# EAGLE design Ex Sensors (EAGLE 7.6.0)
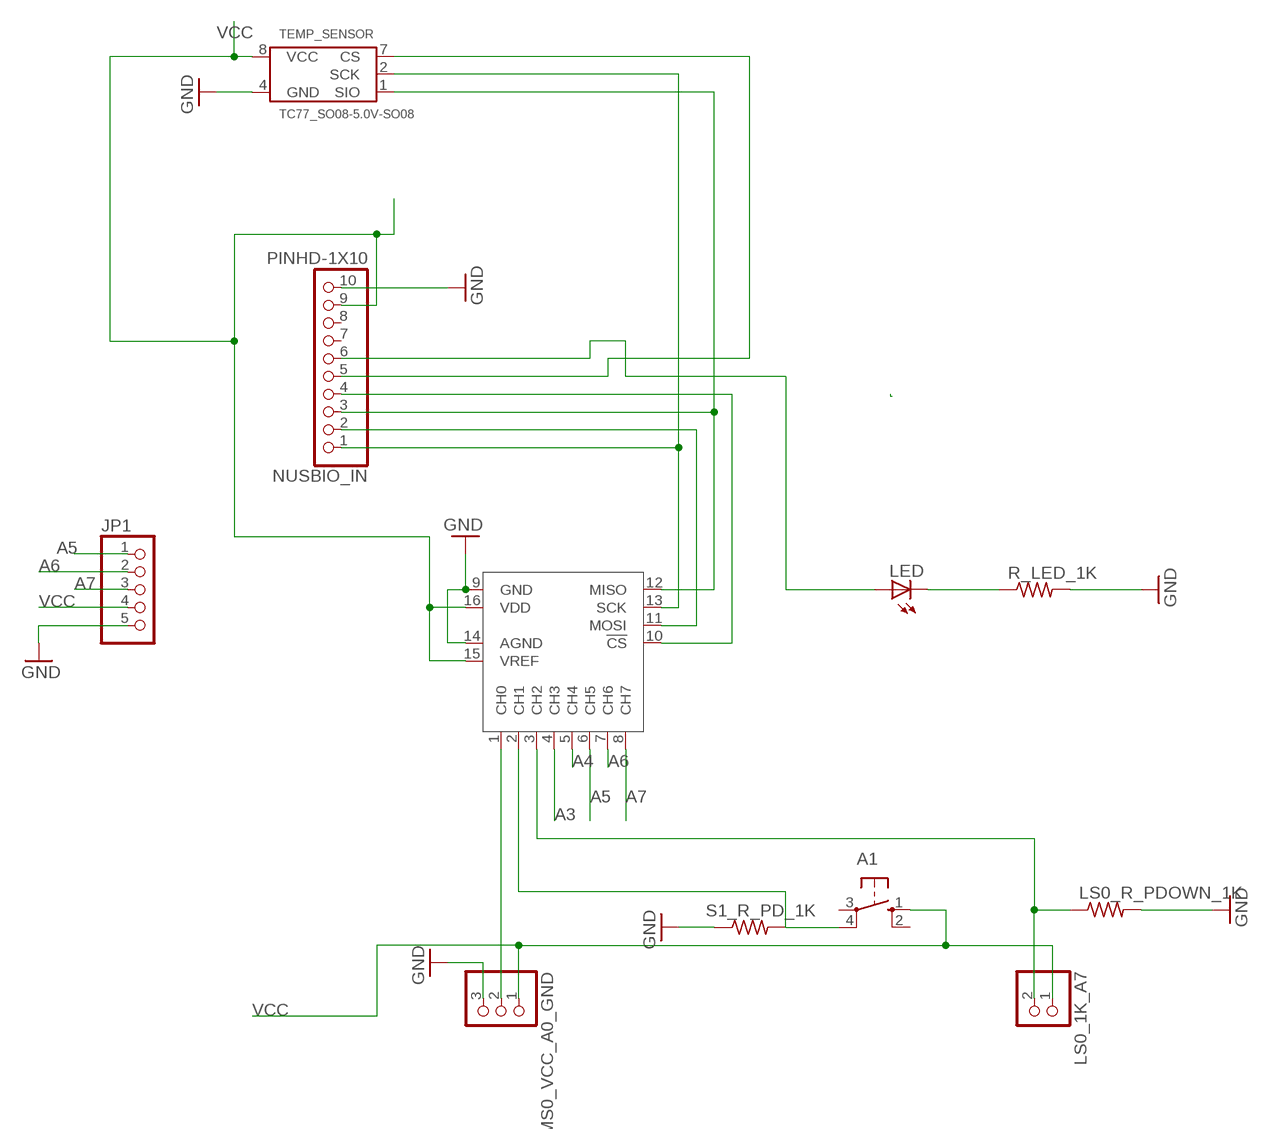
[diagram p0: schematic, sheet 1]

## Parts
A1  10-XX  [B3F-10XX]
JP1  PINHD-1X5  [1X05]
LED  LEDCHIPLED_0805  [CHIPLED_0805]
LS0_1K_A7  PINHD-1X2  [1X02]
LS0_R_PDOWN_1K  R-US_R0805  [R0805]
MS0_VCC_A0_GND  PINHD-1X3  [1X03]
NUSBIO_IN  PINHD-1X10  [1X10-BIG]
R_LED_1K  R-US_R0805  [R0805]
S1_R_PD_1K  R-US_R0805  [R0805]
TEMP_SENSOR  TC77_SO08-5.0V-SO08  [SO-08]
U$1  MCP3008SL  [SO16]

## Nets
A3: U$1.4(CH3)
A4: U$1.5(CH4)
A5: JP1.1 U$1.6(CH5)
A6: JP1.2 U$1.7(CH6)
A7: JP1.3 U$1.8(CH7)
GND: JP1.5 LS0_R_PDOWN_1K.2 MS0_VCC_A0_GND.3 NUSBIO_IN.10 R_LED_1K.2 S1_R_PD_1K.1 TEMP_SENSOR.4(GND) U$1.9(GND) U$1.14(AGND)
N$1: NUSBIO_IN.1 TEMP_SENSOR.2(SCK) U$1.13(SCK)
N$2: NUSBIO_IN.2 U$1.11(MOSI)
N$3: NUSBIO_IN.3 TEMP_SENSOR.1(SIO) U$1.12(MISO)
N$4: NUSBIO_IN.5 TEMP_SENSOR.7(CS)
N$5: NUSBIO_IN.4 U$1.10(!CS)
N$6: LED.C R_LED_1K.1
N$7: LED.A NUSBIO_IN.6
N$10: MS0_VCC_A0_GND.2 U$1.1(CH0)
N$11: LS0_1K_A7.2 LS0_R_PDOWN_1K.1 U$1.3(CH2)
N$12: A1.4(P1) S1_R_PD_1K.2 U$1.2(CH1)
VCC: A1.1(S) JP1.4 LS0_1K_A7.1 MS0_VCC_A0_GND.1 NUSBIO_IN.9 TEMP_SENSOR.8(VCC) U$1.15(VREF) U$1.16(VDD)
Unconnected: A1.2(S1) A1.3(P) NUSBIO_IN.7 NUSBIO_IN.8

## Library data of the parts
A1 = switch-omron:10-XX: OMRON SWITCH; MPN: B3F-1000; OC_FARNELL: 176432; OC_NEWARK: 36M3542
JP1 = pinhead:PINHD-1X5: PIN HEADER
LED = adafruit:LED: LED OSRAM: - CHIPLED LG R971, LG N971, LY N971, LG Q971, LY Q971, LO R971, LY R971 LH N974, LH R974 LS Q976, LO Q976, LY Q976 LO Q996 - Hyper CHIPLED LW Q18S LB Q993, LB Q99A, LB R99A - SideLED LS A670, LO A670, LY A670, LG A670, LP A670 LB A673, LV A673, LT A673, LW A673 LH A674 LY A675 LS A676, LA A676, LO A676, LY A676, LW A676 LS A679, LY A679, LG A679 - Hyper Micro SIDELED® LS Y876, LA Y876, LO Y876, LY Y876 LT Y87S - SmartLED LW L88C, LW L88S LB L89C, LB L89S, LG L890 LS L89K, LO L89K, LY L89K LS L896, LA L896, LO L896, LY L896 - TOPLED LS T670, LO T670, LY T670, LG T670, LP T670 LSG T670, LSP T670, LSY T670, LOP T670, LYG T670 LG T671, LOG T671, LSG T671 LB T673, LV T673, LT T673, LW T673 LH T674 LS T676, LA T676, LO T676, LY T676, LB T676, LH T676, LSB T676, LW T676 LB T67C, LV T67C, LT T67C, LS T67K, LO T67K, LY T67K, LW E67C LS E67B, LA E67B, LO E67B, LY E67B, LB E67C, LV E67C, LT E67C LW T67C LS T679, LY T679, LG T679 LS T770, LO T770, LY T770, LG T770, LP T770 LB T773, LV T773, LT T773, LW T773 LH T774 LS E675, LA E675, LY E675, LS T675 LS T776, LA T776, LO T776, LY T776, LB T776 LHGB T686 LT T68C, LB T68C - Hyper Mini TOPLED® LB M676 - Mini TOPLED Santana® LG M470 LS M47K, LO M47K, LY M47K Source: http://www.osram.convergy.de/
LS0_1K_A7 = pinhead:PINHD-1X2: PIN HEADER
LS0_R_PDOWN_1K R_LED_1K S1_R_PD_1K = adafruit:R-US_: RESISTOR, American symbol
MS0_VCC_A0_GND = adafruit:PINHD-1X3: PIN HEADER
NUSBIO_IN = adafruit:PINHD-1X10: Pin header 1x10 0.1" spacing With round pins
TEMP_SENSOR = temperiture:TC77_SO08: Thermal Sensor with SPI™ Interface TC77 Features • Digital Temperature Sensing in 5-Pin SOT-23A and 8-Pin SOIC Packages • Outputs Temperature as a 13-Bit Digital Word • SPI and MICROWIRE™ Compatible Interface • Solid State Temperature Sensing • ±1°C (max.) accuracy from +25°C to +65°C • ±2°C (max.) accuracy from -40°C to +85°C • ±3°C (max.) accuracy from -55°C to +125°C • 2.7V to 5.5V Operating Range • Low Power - 250 μA (typ.) Continuous Conversion Mode - 0.1 μA (typ.) Shutdown Mode Typical Applications • Thermal Protection for Hard Disk Drives and Other PC Peripherals • PC Card Devices for Notebook Computers • Low Cost Thermostat Controls • Industrial Control • Office Equipment • Cellular Phones • Thermistor Replacement Description The TC77 is a serially accessible digital temperature sensor particularly suited for low cost and small formfactor applications. Temperature data is converted from the internal thermal sensing element and made available at anytime as a 13-bit two’s compliment digital word. Communication with the TC77 is accomplished via a SPI and MICROWIRE compatible interface. It has a 12-bit plus sign temperature resolution of 0.0625°C per Least Significant Bit (LSb). The TC77 offers a temperature accuracy of ±1.0°C (max.) over the temperature range of +25°C to +65°C. When operating, the TC77 consumes only 250 μA (typ.). The TC77’s Configuration register can be used to activate the low power Shutdown mode, which has a current consumption of only 0.1 μA (typ.). Small size, low cost and ease of use make the TC77 an ideal choice for implementing thermal management in a variety of systems.; MPN: TC77-5.0MOA; OC_FARNELL: 1439514; PACKAGE: SO08; SUPPLIER: MICROCHIP
U$1 = MCP3008:MCP3008

## Board
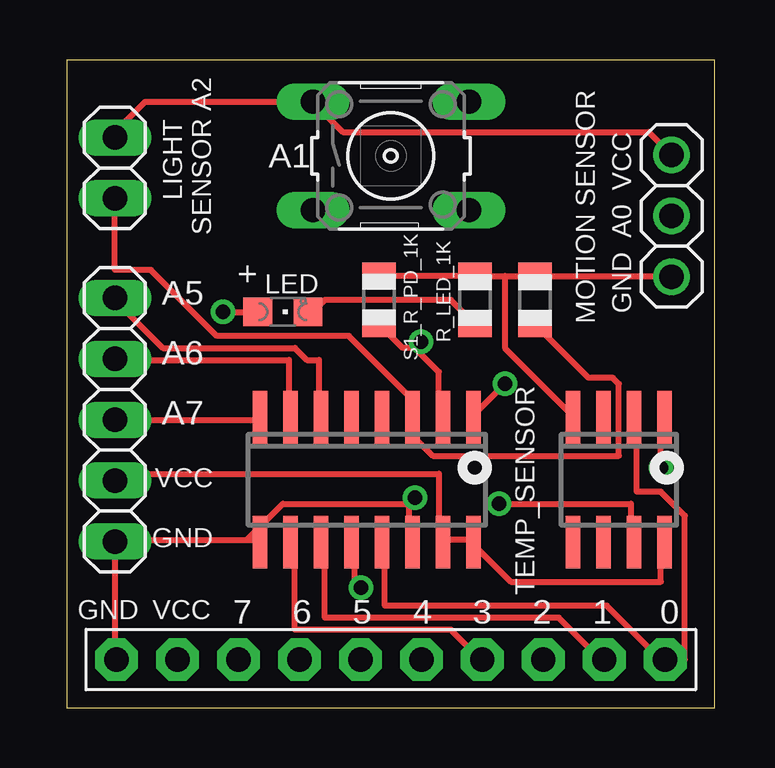
[diagram p1: board, top side]
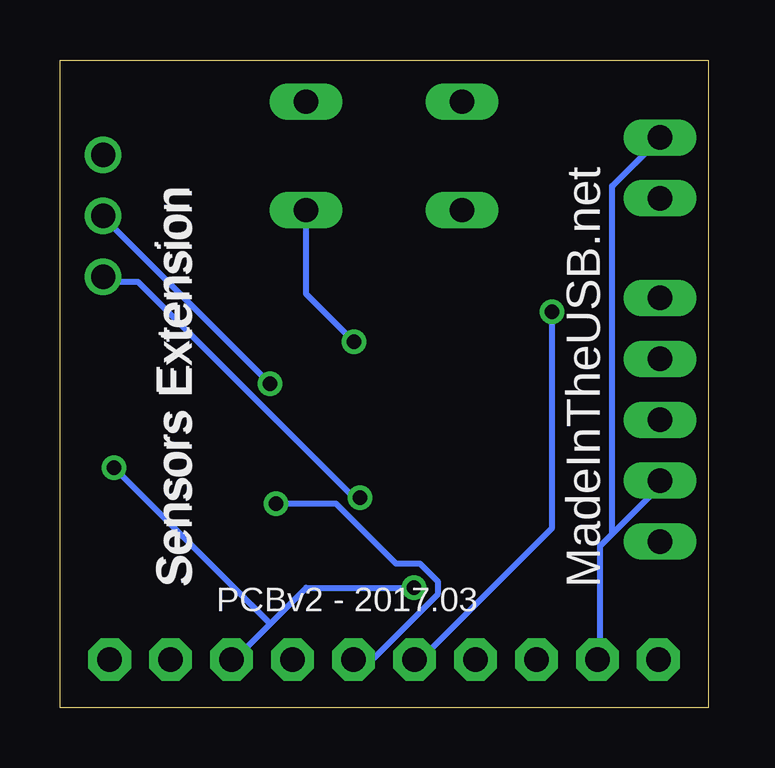
[diagram p2: board, bottom side, seen from below]

Size 27 x 27 mm. Coordinates in mm from the lower left corner, seen from the top.
Outline: 0,0 27,0 27,27 0,27 0,0
Copper layers (1*16): Top 0.035mm / dielectric 1.5mm / Bottom 0.035mm
Design rules "default": minimum track width 10mil, minimum drill 24mil, track to track 8mil, track to pad 8mil, pad to pad 8mil, via to via 8mil, smd to smd 8mil, copper to edge 40mil, drill to drill 8mil, minimum pad ring 10mil, minimum via ring 8mil, stop-mask expansion 4mil, vias tented up to drill 0mil, thermal gap 10mil

### Footprints (pad centres in the part's own frame; a part is rotated, then mirrored left to right if it is on the bottom)
B3F-10XX = drill 1.016 long: 1 -3.251,2.261; 2 3.251,2.261; 3 -3.251,-2.261; 4 3.251,-2.261
1X05 = drill 1.016 long: 1 -5.08,0; 2 -2.54,0; 3 0,0; 4 2.54,0; 5 5.08,0
CHIPLED_0805 = smd 1.2 x 1.2: A 0,-1.05; C 0,1.05
1X02 = drill 1.016 long: 1 -1.27,0; 2 1.27,0
R0805 = smd 1.1 x 1.4: 1 -1,0; 2 1,0
1X03 = drill 1.016: 1 -2.54,0; 2 0,0; 3 2.54,0
1X10-BIG = drill 1.016 pad 1.778 octagon: 1 -11.43,0; 2 -8.89,0; 3 -6.35,0; 4 -3.81,0; 5 -1.27,0; 6 1.27,0; 7 3.81,0; 8 6.35,0; 9 8.89,0; 10 11.43,0
SO-08 = smd 0.6 x 2.2: 1 -1.905,-2.6; 2 -0.635,-2.6; 3 0.635,-2.6; 4 1.905,-2.6; 5 1.905,2.6; 6 0.635,2.6; 7 -0.635,2.6; 8 -1.905,2.6
SO16 = smd 0.6 x 2.2: 1 -4.445,-2.6; 2 -3.175,-2.6; 3 -1.905,-2.6; 4 -0.635,-2.6; 5 0.635,-2.6; 6 1.905,-2.6; 7 3.175,-2.6; 8 4.445,-2.6; 9 4.445,2.6; 10 3.175,2.6; 11 1.905,2.6; 12 0.635,2.6; 13 -0.635,2.6; 14 -1.905,2.6; 15 -3.175,2.6; 16 -4.445,2.6

### Placement (x,y rotation side)
A1  13.5,23 0 top
JP1  2,12 270 top
LED  9,16.5 270 top
LS0_1K_A7  2,22.5 270 top
LS0_R_PDOWN_1K  19.5,17 90 top
MS0_VCC_A0_GND  25.2,20.5 270 top
NUSBIO_IN  13.5,2 180 top
R_LED_1K  17,17 90 top
S1_R_PD_1K  13,17 270 top
TEMP_SENSOR  23,9.5 180 top
U$1  12.5,9.5 180 top

### Tracks (layer width: path | path; a pad name or v marks a point on that pad's centre or on a via)
A5
  Top 0.254: U$1.6 10.5,12.25 10.5,14.5 10,14.5 9.5,15 4,15 2,17 JP1.1
A6
  Top 0.254: U$1.7 9.25,12.25 9.25,14.5 2,14.5 JP1.2
A7
  Top 0.254: JP1.3 8,12 U$1.8
GND  (via drill 0.61)
  Top 0.254: S1_R_PD_1K.1 R_LED_1K.2 18.25,18 | 18.25,18 LS0_R_PDOWN_1K.2 25,18 MS0_VCC_A0_GND.3 | 18.25,18 18.25,15 21,12.25 TEMP_SENSOR.4 | 7.5,7 2,7 JP1.5 2,2 NUSBIO_IN.10 | 7.5,7 8,7 U$1.9 | 14.25,8.5 14.25,7 U$1.14 | 14.25,8.5 9,8.5 7.5,7 | 14.25,8.5 v14.5,8.75
  Bottom 0.254: v14.5,8.75 14.75,8.75 23.75,17.75 25,17.75 MS0_VCC_A0_GND.3
N$1
  Top 0.254: U$1.13 13.25,6.75 13.25,4.25 22.5,4.25 24.75,2 NUSBIO_IN.1 25.75,2 25.75,8 24.75,9 23.75,9 23.75,12 TEMP_SENSOR.2
N$2
  Top 0.254: U$1.11 10.75,6.75 10.75,3.75 20.5,3.75 22.25,2 NUSBIO_IN.2
N$3  (via drill 0.61)
  Top 0.254: v12.25,5 12,5 12,6.75 U$1.12 | v24.75,10 24.75,12 TEMP_SENSOR.1
  Bottom 0.254: v12.25,5 16.75,5 18.25,3.5 | 18.25,3.5 19.75,2 NUSBIO_IN.3 | 18.25,3.5 v24.75,10
N$4  (via drill 0.61)
  Top 0.254: v18,8.5 23.5,8.5 23.5,7 TEMP_SENSOR.7
  Bottom 0.254: v18,8.5 15.5,8.5 13,6 12,6 11.25,5.25 11.25,4.75 14,2 NUSBIO_IN.5
N$5
  Top 0.254: U$1.10 9.5,6.75 9.5,3.25 16,3.25 17.25,2 NUSBIO_IN.4
N$6
  Top 0.254: R_LED_1K.1 16,17 10.75,17 10.25,16.5 LED.C
N$7  (via drill 0.61)
  Top 0.254: v6.5,16.5 LED.A
  Bottom 0.254: v6.5,16.5 6.5,7.5 12,2 NUSBIO_IN.6
N$10  (via drill 0.61)
  Top 0.254: v18.25,13.5 17,12.25 U$1.1
  Bottom 0.254: v18.25,13.5 25.25,20.5 MS0_VCC_A0_GND.2
N$11
  Top 0.254: LS0_R_PDOWN_1K.1 21.75,13.75 22.75,13.75 23,13.5 23,10.5 15.25,10.5 14.5,11.25 14.5,12 U$1.3 14.25,12.25 14.25,13 11.75,15.5 6.25,15.5 3.5,18.25 2,18.25 LS0_1K_A7.2
N$12  (via drill 0.61)
  Top 0.254: S1_R_PD_1K.2 14,15 14.5,15 | 14.5,15 15.5,14 15.5,12.25 U$1.2 | 14.5,15 v14.75,15.25
  Bottom 0.254: v14.75,15.25 16.75,17.25 16.75,20.5 A1.4
VCC
  Top 0.254: LS0_1K_A7.1 2,24 3.25,25.25 10,25.25 A1.1 11.5,24 24.25,24 25,23.25 MS0_VCC_A0_GND.1 | TEMP_SENSOR.8 24.75,6.75 24.75,5.25 18.5,5.25 17,6.75 U$1.16 16.75,7 15.75,7 U$1.15 15.5,7 15.5,9.75 2.25,9.75 2,9.5 JP1.4
  Bottom 0.254: 4,7.25 4.5,6.75 4.5,2 NUSBIO_IN.9 | 4,7.25 2,9.25 JP1.4 | 4,7.25 4,21.75 2,23.75 LS0_1K_A7.1

### Text on the board
tNames: VCC | LIGHT / SENSOR A2 | A0 | GND | A5 | + | MOTION SENSOR | A6 | A7 | VCC | GND | GND | VCC | 7 | 6 | 5 | 4 | 3 | 2 | 1 | 0
bNames: MadeInTheUSB.net | Sensors Extension | Sensors Extension | PCBv2 - 2017.03